# EAGLE design board2 (EAGLE 7.2.0)
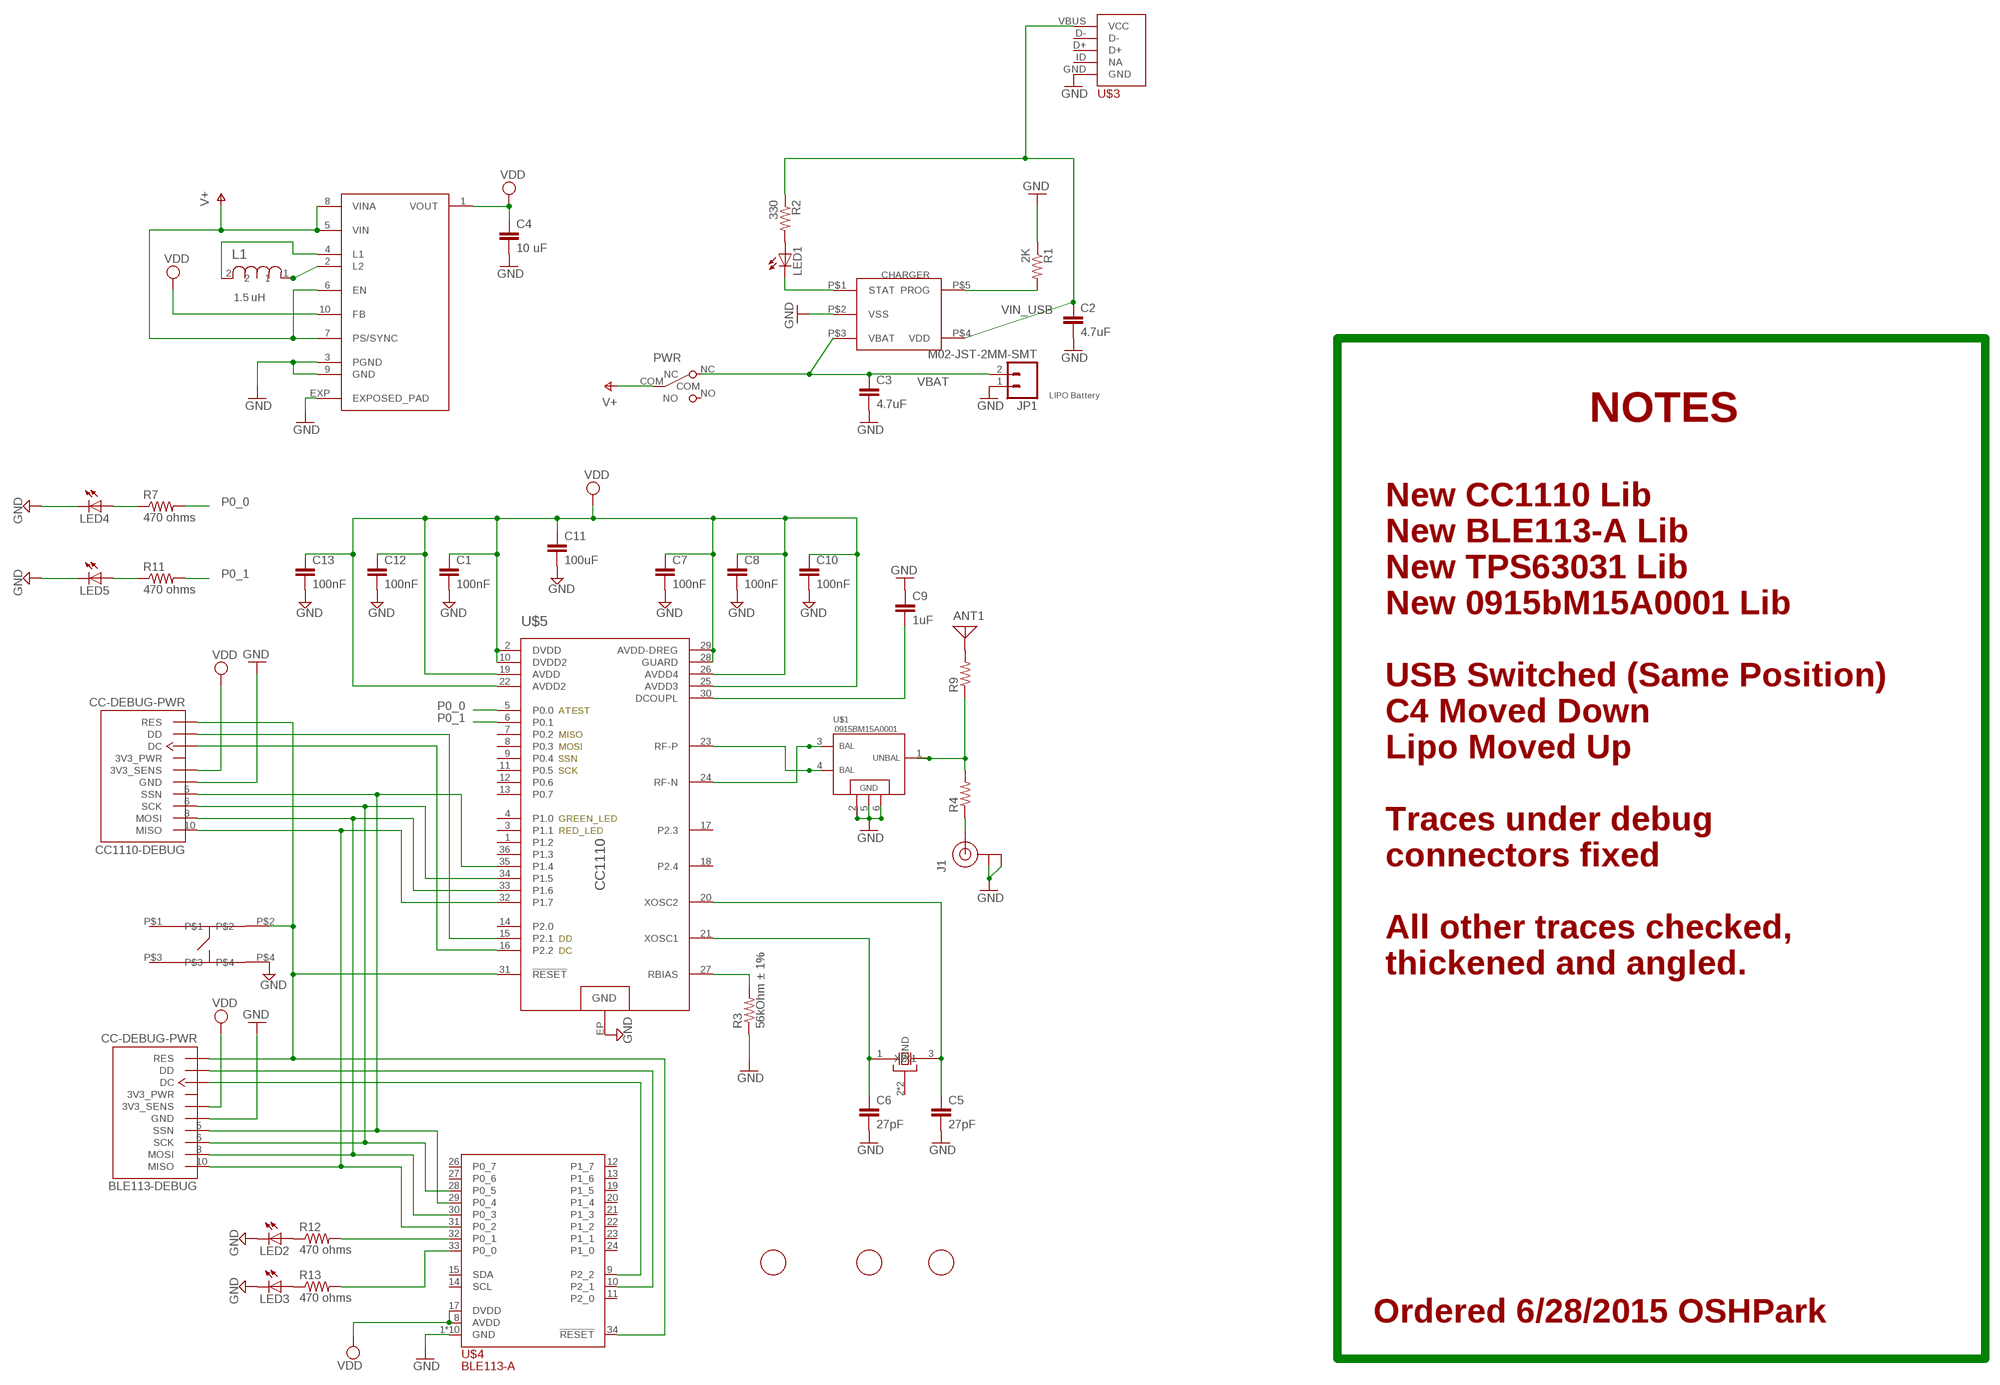
[diagram p0: schematic, sheet 1]

## Parts
ANT1  ANTENNA  [PAD-01]
BLE113-DEBUG  CC-DEBUG-PWR  [CC-P05]
C1  100nF  C-EUC0402  [C0402]
C2  4.7uF  C-EUC0402K  [C0402K]
C3  4.7uF  C-EUC0603K  [C0603K]
C4  10 uF  C-EUC0805K  [C0805K]
C5  27pF  C-EUC0402K  [C0402K]
C6  27pF  C-EUC0402K  [C0402K]
C7  100nF  C-EUC0402  [C0402]
C8  100nF  C-EUC0402  [C0402]
C9  1uF  C-EUC0402K  [C0402K]
C10  100nF  C-EUC0402  [C0402]
C11  100uF  C-EUC0402  [C0402]
C12  100nF  C-EUC0402  [C0402]
C13  100nF  C-EUC0402  [C0402]
CC1110-DEBUG  CC-DEBUG-PWR  [CC-P05]
CHARGER  MCP73831  [5PIN_SOT23]
FID1  FIDUCIAL  [FIDUCIAL_1MM]
FID2  FIDUCIAL  [FIDUCIAL_1MM]
FID3  FIDUCIAL  [FIDUCIAL_1MM]
J1  U.FL  [U.FL]
JP1  M02-JST-2MM-SMT  [JST-2-SMD]
L1  1.5 uH  PM0603-R12J-RC  [INDC1610X12N]
LED1  LEDSML0603  [SML0603]
LED2  LEDSML0603  [SML0603]
LED3  LEDSML0603  [SML0603]
LED4  LEDSML0603  [SML0603]
LED5  LEDSML0603  [SML0603]
PWR  SW_SLIDE  [SLIDE_SWITCH_SMD]
R1  2K  R-US_R0402  [R0402]
R2  330  R-US_R0402  [R0402]
R3  56kOhm ± 1%  R-US_R0402  [R0402]
R4  R-US_R0402  [R0402]
R7  470 ohms  R-US_R0402  [R0402]
R9  R-US_R0402  [R0402]
R11  470 ohms  R-US_R0402  [R0402]
R12  470 ohms  R-US_R0402  [R0402]
R13  470 ohms  R-US_R0402  [R0402]
U$1  0915BM15A0001_BANDPASS  [0915BM15A0001]
U$2  TACTILE_SWITCH  [PTS540]
U$3  USB_GENERICMINI_B  [USB_GENERIC]
U$4  BLE113-A  [BLE113-A]
U$5  CC1110  [QFN36]
U$6  TPS63031  [10SON]
X1  26MHz 10pF 10ppm -20C +70C  CTS_32X25_SMD  [CTS_32X25]

## Nets
DC: CC1110-DEBUG.3(DC) U$5.16(P2.2)
DC_BLE: BLE113-DEBUG.3(DC) U$4.9(P2_2)
DD: CC1110-DEBUG.4(DD) U$5.15(P2.1)
DD_BLE: BLE113-DEBUG.4(DD) U$4.10(P2_1)
GND: BLE113-DEBUG.1(GND) C1.2 C2.2 C3.2 C4.2 C5.2 C6.2 C7.2 C8.2 C9.1 C10.2 C11.2 C12.2 C13.2 CC1110-DEBUG.1(GND) CHARGER.P$2(VSS) J1.P$1(GND) J1.P$2(GND) JP1.1 LED2.C LED3.C LED4.C LED5.C R1.1 R3.1 U$1.2 U$1.5 U$1.6 U$2.P$4 U$3.GND U$4.1(GND) U$4.2(GND) U$4.3(GND) U$4.4(GND) U$4.5(GND) U$4.6(GND) U$4.7(GND) U$4.18(GND) U$4.25(GND) U$4.36(GND) U$5.EP(GND2) U$6.3(PGND) U$6.9(GND) U$6.EXP(EXPOSED_PAD)
MISO: BLE113-DEBUG.10(MISO) CC1110-DEBUG.10(MISO) U$4.31(P0_2) U$5.32(P1.7)
MOSI: BLE113-DEBUG.8(MOSI) CC1110-DEBUG.8(MOSI) U$4.30(P0_3) U$5.33(P1.6)
N$1: L1.1 U$6.2(L2)
N$2: CHARGER.P$1(STAT) LED1.C
N$3: CHARGER.P$5(PROG) R1.2
N$4: LED1.A R2.2
N$5: U$1.3 U$5.24(RF-N)
N$6: L1.2 U$6.4(L1)
N$7: U$1.4 U$5.23(RF-P)
N$9: J1.P$3(SIGNAL) R4.1
N$10: R4.2 R9.1 U$1.1
N$12: ANT1.1 R9.2
N$14: R3.2 U$5.27(RBIAS)
N$18: C9.2 U$5.30(DCOUPL)
N$20: C6.1 U$5.21(XOSC1) X1.1(X1)
N$21: C5.1 U$5.20(XOSC2) X1.3(X2)
N$24: LED4.A R7.1
N$25: LED5.A R11.1
N$29: LED2.A R12.1
N$30: LED3.A R13.1
N$31: R12.2 U$4.32(P0_1)
N$32: R13.2 U$4.33(P0_0)
P0_0: R7.2 U$5.5(P0.0)
P0_1: R11.2 U$5.6(P0.1)
RESET: BLE113-DEBUG.7(RES) CC1110-DEBUG.7(RES) U$2.P$2 U$4.34(!RESET!) U$5.31(!RESET)
SCK: BLE113-DEBUG.6(SCK) CC1110-DEBUG.6(SCK) U$4.28(P0_5) U$5.34(P1.5)
SSN: BLE113-DEBUG.5(SSN) CC1110-DEBUG.5(SSN) U$4.29(P0_4) U$5.35(P1.4)
V+: PWR.COM U$6.5(VIN) U$6.6(EN) U$6.7(PS/SYNC) U$6.8(VINA)
VBAT: C3.1 CHARGER.P$3(VBAT) JP1.2 PWR.NC
VDD: BLE113-DEBUG.2(3V3_SENS) C1.1 C4.1 C7.1 C8.1 C10.1 C11.1 C12.1 C13.1 CC1110-DEBUG.2(3V3_SENS) U$4.8(AVDD) U$4.17(DVDD) U$5.2(DVDD) U$5.10(DVDD2) U$5.19(AVDD) U$5.22(AVDD2) U$5.25(AVDD3) U$5.26(AVDD4) U$5.28(GUARD) U$5.29(AVDD-DREG) U$6.1(VOUT) U$6.10(FB)
VIN_USB: C2.1 CHARGER.P$4(VDD) R2.1 U$3.VBUS(VCC)
Unconnected: BLE113-DEBUG.9(3V3_PWR) CC1110-DEBUG.9(3V3_PWR) PWR.NO U$2.P$1 U$2.P$3 U$3.D+ U$3.D- U$3.ID(NA) U$4.11(P2_0) U$4.12(P1_7) U$4.13(P1_6) U$4.14(SCL) U$4.15(SDA) U$4.19(P1_5) U$4.20(P1_4) U$4.21(P1_3) U$4.22(P1_2) U$4.23(P1_1) U$4.24(P1_0) U$4.26(P0_7) U$4.27(P0_6) U$5.1(P1.2) U$5.3(P1.1) U$5.4(P1.0) U$5.7(P0.2) U$5.8(P0.3) U$5.9(P0.4) U$5.11(P0.5) U$5.12(P0.6) U$5.13(P0.7) U$5.14(P2.0) U$5.17(P2.3) U$5.18(P2.4) U$5.36(P1.3)

## Notes on the sheet
- LIPO Battery
- NOTES
- New CC1110 Lib
  New BLE113-A Lib
  New TPS63031 Lib
  New 0915bM15A0001 Lib
- USB Switched (Same Position)
  C4 Moved Down
  Lipo Moved Up
- Traces under debug 
  connectors fixed
- All other traces checked, 
  thickened and angled.
- Ordered 6/28/2015 OSHPark

## Power pins joined to a net without a drawn wire
GND: X1.2(GND) X1.4(GND)

## Library data of the parts
ANT1 = discrete:ANTENNA: Antenna
BLE113-DEBUG CC1110-DEBUG = parts:CC-DEBUG-PWR: CC debugger connection with various form factors. 2x5-pin 0.05" pitch header include Pin 9 (VDD) supply connection as separate pin. https://github.com/jrowberg/sf-oshw Last updated 2014-01-04 by Jeff Rowberg <jeff@rowberg.net>
C1-C13 = rcl:C-EU: CAPACITOR, European symbol
CHARGER = parts:MCP73831: Digikey No:- __MCP73831T-2ACI/OTCT-ND__
FID1-FID3 = adafruit:FIDUCIAL: For use by pick and place machines to calibrate the vision/machine, 1mm By microbuilder.eu
J1 = SparkFun-Connectors:U.FL: SMD antenna connector- WRL-09144; PROD_ID: CONN-09193
JP1 = SparkFun-Connectors:M02: Standard 2-pin 0.1" header. Use with - straight break away headers ( PRT-00116) - right angle break away headers (PRT-00553) - swiss pins (PRT-00743) - machine pins (PRT-00117) - female headers (PRT-00115) Molex polarized connector foot print use with: PRT-08233 with associated crimp pins and housings. 2.54_SCREWTERM for use with PRT-10571. 3.5mm Screw Terminal footprints for PRT-08084 5mm Screw Terminal footprints for use with PRT-08432; PROD_ID: CONN-08352
L1 = Bourns_By_element14_Batch_1:PM0603-R12J-RC: CHIP INDUCTOR, 120NH, 300MA, 5%, 1300MHZ; MPN: PM0603-R12J-RC; OC_FARNELL: -; OC_NEWARK: 86K1771; SUPPLIER: BOURNS; TOLERANCE: ±5 %; VALUE: 120 nH
LED1-LED5 = led:LED: LED OSRAM: - CHIPLED LG R971, LG N971, LY N971, LG Q971, LY Q971, LO R971, LY R971 LH N974, LH R974 LS Q976, LO Q976, LY Q976 LO Q996 - Hyper CHIPLED LW Q18S LB Q993, LB Q99A, LB R99A - SideLED LS A670, LO A670, LY A670, LG A670, LP A670 LB A673, LV A673, LT A673, LW A673 LH A674 LY A675 LS A676, LA A676, LO A676, LY A676, LW A676 LS A679, LY A679, LG A679 - Hyper Micro SIDELED® LS Y876, LA Y876, LO Y876, LY Y876 LT Y87S - SmartLED LW L88C, LW L88S LB L89C, LB L89S, LG L890 LS L89K, LO L89K, LY L89K LS L896, LA L896, LO L896, LY L896 - TOPLED LS T670, LO T670, LY T670, LG T670, LP T670 LSG T670, LSP T670, LSY T670, LOP T670, LYG T670 LG T671, LOG T671, LSG T671 LB T673, LV T673, LT T673, LW T673 LH T674 LS T676, LA T676, LO T676, LY T676, LB T676, LH T676, LSB T676, LW T676 LB T67C, LV T67C, LT T67C, LS T67K, LO T67K, LY T67K, LW E67C LS E67B, LA E67B, LO E67B, LY E67B, LB E67C, LV E67C, LT E67C LW T67C LS T679, LY T679, LG T679 LS T770, LO T770, LY T770, LG T770, LP T770 LB T773, LV T773, LT T773, LW T773 LH T774 LS E675, LA E675, LY E675, LS T675 LS T776, LA T776, LO T776, LY T776, LB T776 LHGB T686 LT T68C, LB T68C - Hyper Mini TOPLED® LB M676 - Mini TOPLED Santana® LG M470 LS M47K, LO M47K, LY M47K Source: http://www.osram.convergy.de LUXEON: - LUMILED® LXK2-PW12-R00, LXK2-PW12-S00, LXK2-PW14-U00, LXK2-PW14-V00 LXK2-PM12-R00, LXK2-PM12-S00, LXK2-PM14-U00 LXK2-PE12-Q00, LXK2-PE12-R00, LXK2-PE12-S00, LXK2-PE14-T00, LXK2-PE14-U00 LXK2-PB12-K00, LXK2-PB12-L00, LXK2-PB12-M00, LXK2-PB14-N00, LXK2-PB14-P00, LXK2-PB14-Q00 LXK2-PR12-L00, LXK2-PR12-M00, LXK2-PR14-Q00, LXK2-PR14-R00 LXK2-PD12-Q00, LXK2-PD12-R00, LXK2-PD12-S00 LXK2-PH12-R00, LXK2-PH12-S00 LXK2-PL12-P00, LXK2-PL12-Q00, LXK2-PL12-R00 Source: www.luxeon.com KINGBRIGHT: KA-3528ASYC Source: www.kingbright.com
PWR = parts:SW_SLIDE
R1-R4 R7 R9 R11-R13 = rcl:R-US_: RESISTOR, American symbol
U$1 = riley:0915BM15A0001_BANDPASS
U$2 = parts:TACTILE_SWITCH: Ultra Low Profile SMT Top Actuated PTS540 JM035 SMTR LFS Datasheet <http://www.mouser.com/ds/2/60/PTS540_9sept14-372441.pdf>
U$3 = AtomTech:USB_GENERIC
U$4 = riley:BLE113-A
U$5 = riley:CC1110
U$6 = riley:TPS63031
X1 = cts_crystal:CTS_32X25_SMD

## Board
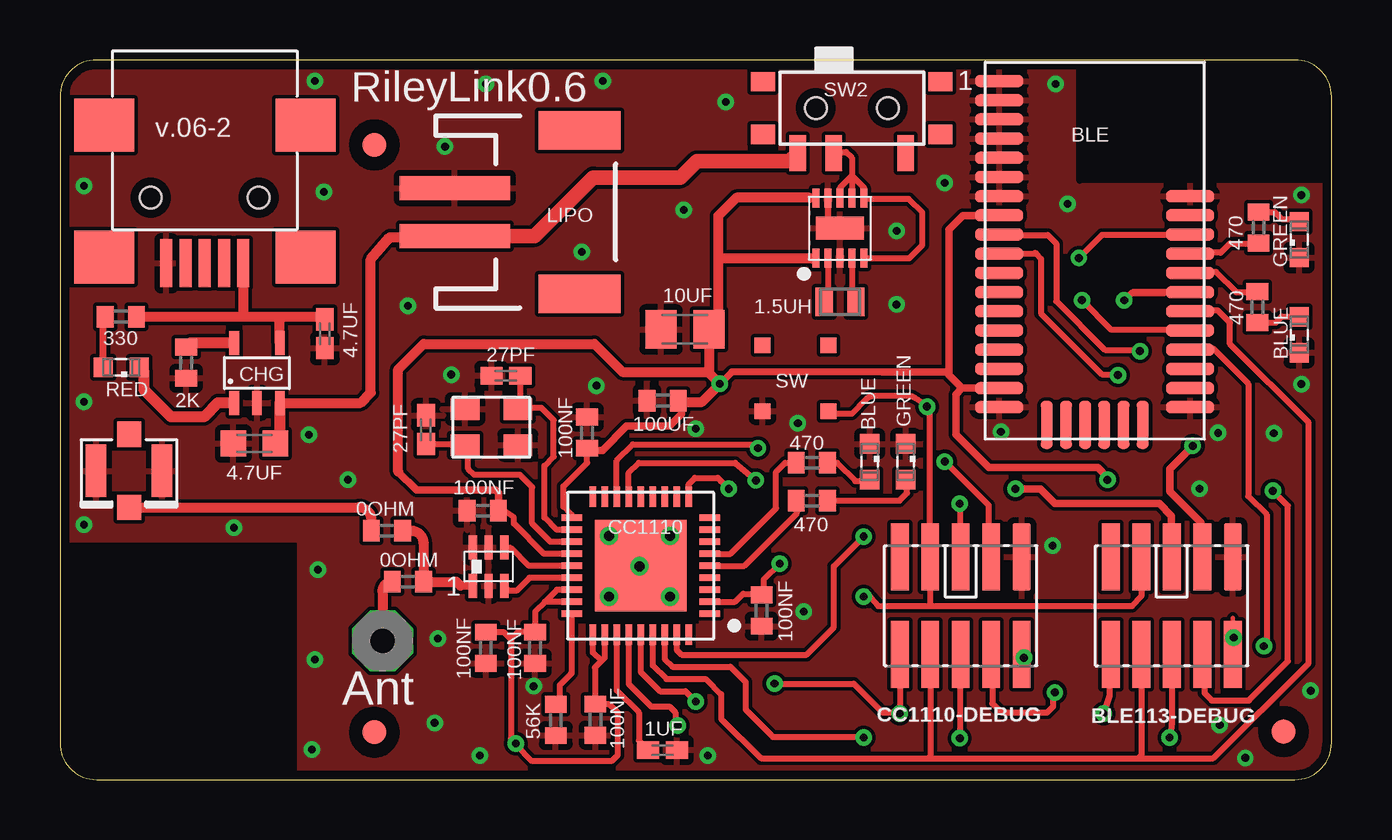
[diagram p1: board, top side]
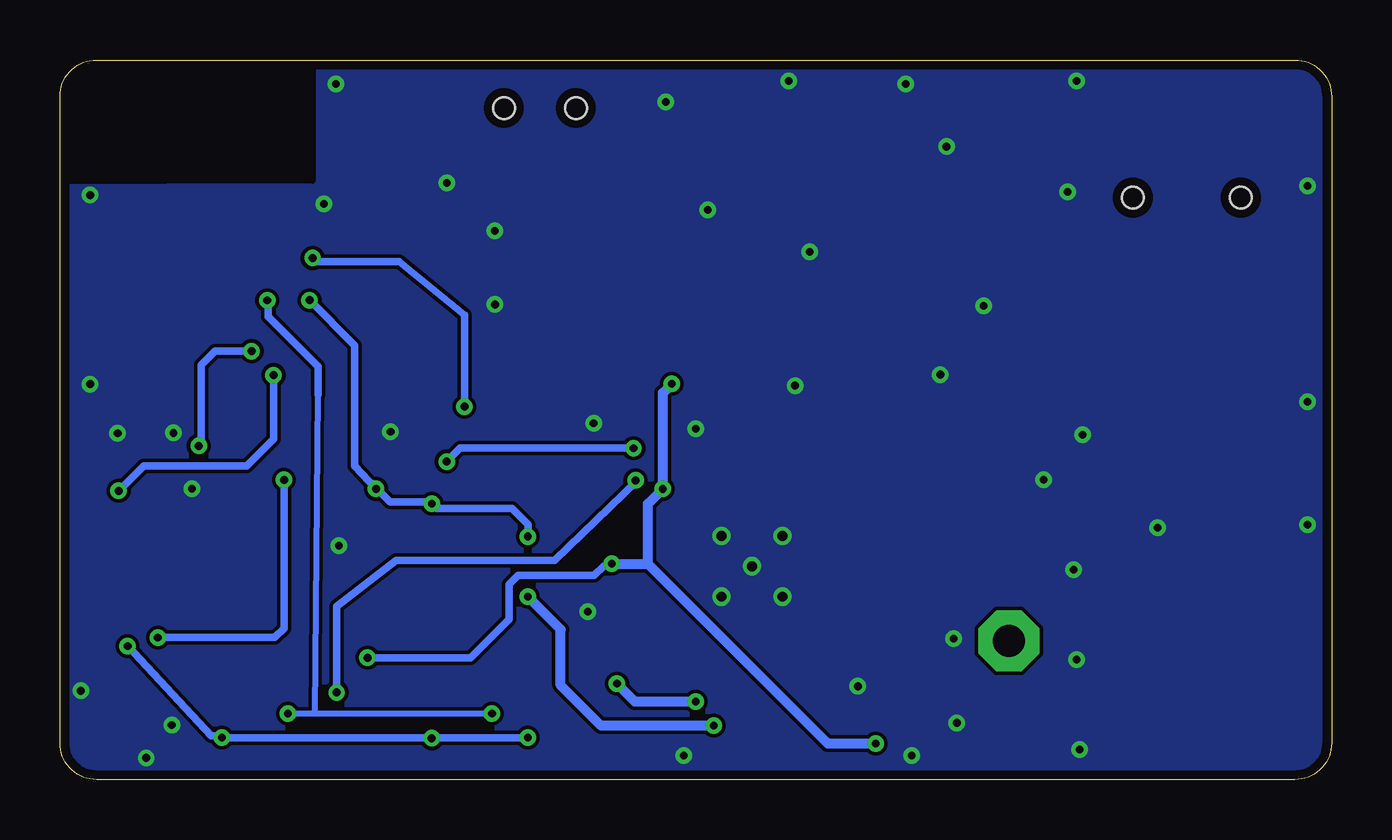
[diagram p2: board, bottom side, seen from below]

Size 53 x 30 mm. Coordinates in mm from the lower left corner, seen from the top.
Outline: 0,28.48 0,1.52 arc90 1.52,0 51.48,0 arc90 53,1.52 53,28.48 arc90 51.48,30 1.52,30 arc90 0,28.48
Copper layers (1*16): Top 0.0356mm / dielectric 1.5011mm / Bottom 0.0356mm
Design rules "oshpark *": minimum track width 6mil, minimum drill 13mil, track to track 6mil, track to pad 6mil, pad to pad 6mil, via to via 6mil, smd to smd 6mil, copper to edge 15mil, drill to drill 6mil, minimum pad ring 7mil, minimum via ring 7mil, stop-mask expansion 3mil, vias tented up to drill 21mil, thermal gap 10mil
tRestrict: area 42.5,25 to 54.6,30.5; area 21.8,6.5 to 26.6,11.4
bRestrict: area 42.5,24.9 to 54.7,30.4

### Footprints (pad centres in the part's own frame; a part is rotated, then mirrored left to right if it is on the bottom)
PAD-01 = drill 1.321 pad 2.54 octagon: 1 0,0
CC-P05 = smd 0.74 x 2.8: 1 -2.54,-2.03; 2 -2.54,2.03; 3 -1.27,-2.03; 4 -1.27,2.03; 5 0,-2.03; 6 0,2.03; 7 1.27,-2.03; 8 1.27,2.03; 9 2.54,-2.03; 10 2.54,2.03
C0402 = smd 0.7 x 0.9: 1 -0.65,0; 2 0.65,0
C0402K = smd 0.925 x 0.74: 1 -0.6,0; 2 0.6,0
C0603K = smd 1.05 x 1.08: 1 -0.875,0; 2 0.875,0
C0805K = smd 1.3 x 1.6: 1 -1,0; 2 1,0
5PIN_SOT23 = smd 0.4 x 1: P$1 0.4,-0.63; P$2 1.35,-0.63; P$3 2.3,-0.63; P$4 2.3,1.87; P$5 0.4,1.87
FIDUCIAL_1MM = smd 1 x 1: 1 0,0
U.FL = smd 2.2 x 0.85: P$1 0,1.375; P$2 0,-1.375 | smd 1.05 x 1: P$3 1.525,0; P$4 -1.525,0
JST-2-SMD = smd 1 x 4.6: 1 -1,-3.7; 2 1,-3.7 | smd 1.6 x 3.4: NC1 -3.4,1.5; NC2 3.4,1.5
INDC1610X12N = smd 0.711 x 1.194: 1 -0.66,0; 2 0.66,0
SML0603 = smd 0.8 x 0.8: A 0.75,0; C -0.75,0
SLIDE_SWITCH_SMD = smd 0.7 x 1.5: COM 0.75,1.875; NC 2.25,1.875; NO -2.25,1.875 | smd 1 x 0.8: P$1 -3.7,-1.1; P$2 -3.7,1.1; P$3 3.7,1.1; P$4 3.7,-1.1 | hole 0.9: -1.5,0; 1.5,0
R0402 = smd 0.7 x 0.9: 1 -0.65,0; 2 0.65,0
0915BM15A0001 = smd 0.35 x 1: 1 -0.64,-0.81; 2 0.01,-0.81; 3 0.66,-0.81; 4 0.66,0.79; 5 0.01,0.79; 6 -0.64,0.79
PTS540 = smd 0.65 x 0.65: P$1 -1.375,1.375; P$2 1.375,1.375; P$3 -1.375,-1.375; P$4 1.375,-1.375
USB_GENERIC = smd 0.5 x 2: D+ -0.04,4.71; D- -0.84,4.71; GND 1.56,4.71; ID 0.76,4.71; VBUS -1.64,4.71 | smd 2.5 x 2.2: GND@1 4.16,-1.04; GND@2 -4.24,-1.04; GND@3 -4.24,4.46; GND@4 4.16,4.46 | hole 0.9: -2.28,1.98; 2.22,1.98
BLE113-A = smd 2 x 0.5: 1 -3.975,7.075; 2 -3.975,6.275; 3 -3.975,5.475; 4 -3.975,4.675; 5 -3.975,3.875; 6 -3.975,3.075; 7 -3.975,2.275; 8 -3.975,1.475; 9 -3.975,0.675; 10 -3.975,-0.125; 11 -3.975,-0.925; 12 -3.975,-1.725; 13 -3.975,-2.525; 14 -3.975,-3.325; 15 -3.975,-4.125; 16 -3.975,-4.925; 17 -3.975,-5.725; 18 -3.975,-6.525; 25 3.975,-6.525; 26 3.975,-5.725; 27 3.975,-4.925; 28 3.975,-4.125; 29 3.975,-3.325; 30 3.975,-2.525; 31 3.975,-1.725; 32 3.975,-0.925; 33 3.975,-0.125; 34 3.975,0.675; 35 3.975,1.475; 36 3.975,2.275 | smd 0.5 x 2: 19 -2,-7.265; 20 -1.2,-7.265; 21 -0.4,-7.265; 22 0.4,-7.265; 23 1.2,-7.265; 24 2,-7.265
QFN36 = smd 0.28 x 0.85: 1 -2,-2.875; 2 -1.5,-2.875; 3 -1,-2.875; 4 -0.5,-2.875; 5 0,-2.875; 6 0.5,-2.875; 7 1,-2.875; 8 1.5,-2.875; 9 2,-2.875; 19 2,2.875; 20 1.5,2.875; 21 1,2.875; 22 0.5,2.875; 23 0,2.875; 24 -0.5,2.875; 25 -1,2.875; 26 -1.5,2.875; 27 -2,2.875 | smd 0.85 x 0.28: 10 2.875,-2; 11 2.875,-1.5; 12 2.875,-1; 13 2.875,-0.5; 14 2.875,0; 15 2.875,0.5; 16 2.875,1; 17 2.875,1.5; 18 2.875,2; 28 -2.875,2; 29 -2.875,1.5; 30 -2.875,1; 31 -2.875,0.5; 32 -2.875,0; 33 -2.875,-0.5; 34 -2.875,-1; 35 -2.875,-1.5; 36 -2.875,-2 | smd 3.8 x 3.8: EP 0,0
10SON = smd 0.28 x 0.8: 1 -1,-1.25; 2 -0.5,-1.25; 3 0,-1.25; 4 0.5,-1.25; 5 1,-1.25; 6 1,1.25; 7 0.5,1.25; 8 0,1.25; 9 -0.5,1.25; 10 -1,1.25 | smd 2 x 0.95: EXP 0,0
CTS_32X25 = smd 1.2 x 0.9: 1 -1.1,-0.7; 2 1.1,-0.7; 3 1.1,0.8; 4 -1.1,0.8

### Placement (x,y rotation side)
ANT1  13.45,5.78 0 top
BLE113-DEBUG  46.34,7.25 180 top
C1  29.24,7.04 270 top
C2  11.04,18.59 270 top
C3  8.1,14.01 180 top
C4  26.05,18.77 180 top
C5  18.59,16.84 180 top
C6  15.26,14.59 90 top
C7  22.32,2.5 270 top
C8  17.75,5.5 270 top
C9  25.11,1.23 180 top
C10  19.8,5.5 270 top
C11  25.12,15.8 180 top
C12  21.97,14.46 90 top
C13  17.62,11.21 180 top
CC1110-DEBUG  37.55,7.25 180 top
CHARGER  6.86,16.33 0 top
FID1  13.1,1.97 0 top
FID2  13.1,26.46 0 top
FID3  51,2 0 top
J1  2.88,12.88 270 top
JP1  20.16,23.66 270 top
L1  32.52,19.92 0 top
LED1  2.55,17.19 180 top
LED2  51.65,18.54 90 top
LED3  51.65,22.51 90 top
LED4  35.25,13.25 270 top
LED5  33.75,13.25 270 top
PWR  33,28 180 top
R1  5.26,17.38 90 top
R2  2.54,19.3 180 top
R3  20.66,2.48 90 top
R4  13.62,10.38 0 top
R7  31.34,11.63 180 top
R9  14.5,8.25 180 top
R11  31.34,13.21 180 top
R12  49.91,19.7 90 top
R13  49.96,23.01 270 top
U$1  17.86,8.89 0 top
U$2  30.66,16.73 270 top
U$3  5.99,26.24 180 top
U$4  43.13,22.05 0 top
U$5  24.21,8.92 90 top
U$6  32.51,22.99 0 top
X1  17.98,14.64 0 top

### Tracks (layer width: path | path; a pad name or v marks a point on that pad's centre or on a via)
DC  (via drill 0.33)
  Top 0.152: 38.71,9.3 CC1110-DEBUG.3
  Top 0.24: v36.88,13.26 38.71,11.43 38.71,9.3
  Top 0.254: v29.09,13.81 28.94,13.97 23.88,13.97 23.21,13.3 U$5.16
  Bottom 0.305: v29.09,13.81 36.33,13.81 v36.88,13.26
DC_BLE  (via drill 0.33)
  Top 0.152: 40.08,22.71 39.47,22.71 | 47.55,9.3 BLE113-DEBUG.3
  Top 0.24: 47.55,9.3 47.55,9.45
  Top 0.254: 40.08,22.71 41.17,22.71 41.53,22.35 41.53,19.94 43.56,17.91 44.8,17.91 v45.01,17.86
  Top 0.305: 47.55,9.45 47.55,10.72 46.25,12.01 46.25,12.95 v47.22,13.91
  Top 0.406: 39.47,22.71 39.17,22.71 U$4.9
  Bottom 0.305: v45.01,17.86 46.53,17.86 47.12,17.27 47.12,14.01 v47.22,13.91
DD  (via drill 0.33)
  Top 0.152: 38.86,4.27 38.86,5.18 CC1110-DEBUG.4
  Top 0.254: v29.01,12.47 28.14,13.21 24.13,13.21 23.71,12.78 U$5.15 | 38.86,4.27 38.86,3.17 39.24,2.79 41.15,2.79 41.4,3.05 41.4,3.56 v41.47,3.63
  Bottom 0.305: v29.01,12.47 28.93,12.47 32.38,9.14 38.99,9.14 41.48,7.21 41.48,4.18 v41.47,3.63
DD_BLE  (via drill 0.33)
  Top 0.152: 47.7,4.27 47.7,5.18 BLE113-DEBUG.4
  Top 0.254: 47.7,4.27 47.7,3.61 48.01,3.3 49.55,3.3 51.18,4.93 51.18,11.41 v50.55,12.04 | 40.65,21.96 40.69,21.92 | v44.1,16.86 44.07,16.89 43.43,16.89 40.89,19.43 40.89,21.72 40.69,21.92 | U$4.10 40.69,21.92
  Bottom 0.305: v44.1,16.86 44.1,14.2 45.21,13.08 49.51,13.08 v50.55,12.04
GND  (via drill 0.33, 0.33 pad 0.41, 0.41)
  Top 0.254: U$6.9 32.01,23.49
  Top 0.26: C10.2 20,5
  other vias: 10.75,8.75 11,24.5 26,23.75 27.75,28.25 34.88,22.88 51.75,24.37 21.75,22 51.75,16.48 52.13,3.7 49.41,0.9 41.38,9.75 16.3,16.88 10.38,14.38 14.5,19.75 10.62,5 15.75,5.88 17.5,1 12,12.5 41.5,29 16.04,26.39 42,24 31,7 19.75,3.89 27,1 47.5,12.12 39.23,14.5 34.87,19.81 1,10.62 7.25,10.5 1,15.75 1,24.75 36.88,24.88 22.62,29.12 17.75,29 10.62,29.12 10.5,1.25 15.62,2.36 22.36,16.42 26.5,14.62 30.75,14.86 22.89,10.16 25.43,10.16 25.43,7.62 22.89,7.62 24.16,8.89 48.27,14.45 48.34,2.27 50.6,14.44
  pour Bottom: 0,30 53,30 53,0 0,0
  pour Top: 10,0 10,10 0,10 0,30 53,30 53,0
MISO  (via drill 0.33)
  Top 0.152: 46.02,20.27 46.79,20.27
  Top 0.24: v43.5,2.75 43.75,3.5 43.75,5.17 BLE113-DEBUG.10
  Top 0.254: v26.5,3.25 26.07,3.68 25.02,3.68 24.21,4.5 U$5.32 | v29.79,4 33.08,4 34.29,2.79 35.21,2.79 v35,2.75 35.01,3 CC1110-DEBUG.10 | 46.02,20.27 44.65,20.27 v44.36,19.98 44.7,20.32 U$4.31
  Bottom 0.152: 42.37,2.74 42.37,2.75
  Bottom 0.24: v35,2.75 42.37,2.75 | 42.37,2.75 v43.5,2.75 | 42.37,2.75 42.24,16.05
  Bottom 0.305: 42.24,16.05 42.24,17.22 44.32,19.3 44.32,19.94 v44.36,19.98
  Bottom 0.406: v26.5,3.25 29.04,3.25 v29.79,4
MOSI
  Top 0.254: 36.2,0.89 29.21,0.89 27.56,2.54 27.56,3.56 26.92,4.19 25.27,4.19 24.71,4.76 U$5.33 | 36.2,0.89 44.96,0.89 | 47.07,19.56 48.26,19.56 48.77,19.05 48.77,18.16 52.05,14.88 52.05,4.85 48.08,0.89 44.96,0.89 | BLE113-DEBUG.8 45.07,1 44.96,0.89 | CC1110-DEBUG.8 36.27,0.97 36.2,0.89 | 46.85,19.56 47.07,19.56 | 47.07,19.56 U$4.30
N$1
  Top 0.254: U$6.2 32.01,20.08 L1.1
  Top 0.305: 31.99,20.06 L1.1
N$2
  Top 0.45: CHARGER.P$1 6.58,15.7 6,15.12 4.62,15.12 3.5,16.25 3.5,16.99 LED1.C
N$3
  Top 0.45: CHARGER.P$5 5.43,18.2 R1.2
N$4
  Top 0.3: LED1.A 1.8,19.21 R2.2
N$5
  Top 0.254: U$5.24 19.57,8.41 19.02,7.87 18.72,7.87 U$1.3
N$6
  Top 0.24: 33.01,21.99 33,22
  Top 0.254: L1.2 33.01,20.08 U$6.4 33.01,21.99
  Top 0.305: 33,20.09 L1.2
N$7
  Top 0.254: 18.62,9.65 18.8,9.65 19.53,8.91 U$5.23
  Top 0.305: 18.62,9.65 18.54,9.65 U$1.4
N$9
  Top 0.406: J1.P$3 12.47,11.35 arc-90 12.97,10.84 R4.1
N$10
  Top 0.305: 16.69,8.08 U$1.1
  Top 0.406: R4.2 14.64,10.38 arc-90 15.15,9.87 R9.1 16.52,8.25 16.69,8.08
N$12
  Top 0.406: R9.2 arc90 13.45,7.84 ANT1.1
N$14
  Top 0.254: R3.2 20.83,3.04 20.83,3.94 21.23,4.34 21.31,4.42 21.33,4.44 U$5.27
N$18
  Top 0.254: C9.2 24.13,1.61 24.13,2.79 23.21,3.72 U$5.30
N$20
  Top 0.24: C6.1 16.84,13.98 X1.1
  Top 0.254: X1.1 17.02,13.81 17.02,12.95 17.27,12.7 19.18,12.7 19.68,12.19 19.68,10.67 20.44,9.91 U$5.21
N$21
  Top 0.24: 19.38,15.62 19,15.62 19.08,15.54 19.18,15.54 | C5.1 19.18,15.54 | 19.18,15.54 X1.3
  Top 0.254: X1.3 19.13,15.49 20.07,15.49 20.57,14.99 20.57,13.46 20.19,13.08 20.19,10.92 20.7,10.41 U$5.20
N$24
  Top 0.254: R7.1 35,11.63 35.31,11.94 35.31,12.44 LED4.A
N$25
  Top 0.254: R11.1 32.39,13.21 33.15,12.45 33.7,12.45 LED5.A
N$29
  Top 0.254: R12.1 50.67,19.05 50.93,19.3 51.64,19.3 LED2.A
N$30
  Top 0.254: R13.1 50.63,23.66 50.93,23.37 51.54,23.37 LED3.A
N$31
  Top 0.254: R12.2 49.63,20.32 49.02,20.32 48.18,21.16 47.15,21.16 U$4.32
N$32
  Top 0.254: R13.2 49.7,22.35 48.77,22.35 48.38,21.96 47.15,21.96 U$4.33
P0_0
  Top 0.254: 30.73,11.18 30.73,11.59 R7.2 30.71,11.61 30.71,11.1 28.52,8.91 U$5.5
P0_1
  Top 0.254: R11.2 30.23,13.21 29.84,12.83 29.84,11.3 27.96,9.41 U$5.6
RESET  (via drill 0.33)
  Top 0.152: 36.27,15.54 36.25,15.5
  Top 0.24: CC1110-DEBUG.7 36.25,8.64 36.25,15.5 35.63,15.91 arc34 35.35,16 33.96,16 arc45 33.6,15.85 33,15.25 32.14,15.25 U$2.P$2 | 36.27,15.54 v36.14,15.54
  Top 0.254: v25.75,2.25 25.65,2.35 25.65,2.79 25.4,3.05 24.64,3.05 23.71,3.98 U$5.31 | v42.47,21.74 43.43,22.71 47.09,22.71 U$4.34 | v33.5,7.62 33.78,7.62 34.11,7.24 36.27,7.24 | 36.27,7.24 44.68,7.24 45.09,7.67 45.09,9.27 BLE113-DEBUG.7 | 36.25,8.64 36.25,7.31 36.27,7.24
  Bottom 0.305: v36.14,15.54 36.14,19.36 38.86,21.59 42.32,21.59 v42.47,21.74
  Bottom 0.406: v25.75,2.25 30.44,2.25 32.13,3.94 32.13,6.26 v33.5,7.62
SCK  (via drill 0.33)
  Top 0.24: 37.5,4.42 CC1110-DEBUG.6 | BLE113-DEBUG.6 46.34,2.34 v46.25,1.75
  Top 0.254: v33.5,1.75 33.47,1.78 29.72,1.78 28.57,2.92 28.57,4.06 27.94,4.7 25.53,4.7 25.21,5.02 U$5.34 | 37.5,4.42 v37.5,1.72 | v50.18,5.56 50.29,5.42 50.29,11.05 49.53,11.81 49.53,16.51 48.08,17.96 47.15,17.96 U$4.28
  Bottom 0.152: 46.33,1.83 v46.25,1.75
  Bottom 0.24: 37.47,1.75 v37.5,1.72
  Bottom 0.305: v33.5,1.75 37.47,1.75 | 37.47,1.75 v37.5,1.72 | 37.47,1.75 v46.25,1.75 | 46.33,1.83 46.7,1.83 v50.18,5.56
SSN  (via drill 0.33)
  Top 0.152: 46.33,10.67 46.33,9.3 BLE113-DEBUG.5
  Top 0.24: v37.5,11.5 37.5,8.57 CC1110-DEBUG.5
  Top 0.254: v33.5,10.13 32.26,8.89 32.26,6.35 31.11,5.21 25.91,5.21 25.71,5.41 U$5.35 | v42.6,19.98 43.83,18.75 47.08,18.75 U$4.29
  Top 0.305: 46.33,10.67 46.33,11 45.82,11.51 41.48,11.51 40.87,12.12 v39.83,12.12 v39.82,12.12
  Bottom 0.152: 37.64,11.58 v37.5,11.5
  Bottom 0.305: v33.5,10.13 33.5,10.64 34.16,11.3 37.3,11.3 v37.5,11.5 | 37.64,11.58 39.24,11.58 39.99,12.34 v39.82,12.12 40.72,13.06 40.72,18.1 v42.6,19.98
V+
  Top 0.254: 33.01,25.17 33.01,25.92 32.77,26.16 32.29,26.16 | 33.01,25.17 U$6.7 | U$6.5 35.4,21.74 35.94,22.28 35.94,23.65 35.38,24.21 33.54,24.21 U$6.6 33.51,24.67 33.01,25.17 | U$6.8 32.51,24.68 33.01,25.17
  Top 0.406: 32.29,26.16 PWR.COM
VBAT
  Top 0.406: CHARGER.P$3 12.53,15.7 12.95,16.13 12.95,21.69 13.74,22.61 16.33,22.61 JP1.2
  Top 0.45: CHARGER.P$3 9.16,14.19 C3.1
  Top 0.61: JP1.2 19.79,22.66 22.23,25.09 25.86,25.09 26.54,25.78 30.41,25.78 PWR.NC
VDD  (via drill 0.33)
  Top 0.152: 40.23,5.33 CC1110-DEBUG.2 40.08,5.33 | 48.77,5.33 BLE113-DEBUG.2 | C11.1 25.76,15.85 25.76,15.75
  Top 0.178: 22.73,3.17 C7.1 | BLE113-DEBUG.2 48.9,5.24 48.9,6.73
  Top 0.24: 25.76,15.75 25.75,15.75 | 21.88,13.71 C12.1
  Top 0.254: 27.55,12.45 v27.88,12.12 27.42,12.57 26.47,12.57 26.21,12.31 U$5.10 | 21.84,13.68 C12.1 21.97,13.21 20.99,12.22 20.99,11.38 21.33,11.04 U$5.19 | C8.1 18.49,6.15 18.8,5.84 | 18.8,5.84 18.8,1.7 v19,1.5 19,1.45 19.68,0.76 22.99,0.76 23.24,1.02 23.24,2.79 22.89,3.15 C7.1 | C10.1 19.1,6.15 18.8,5.84 | 18.29,11.3 18.21,11.23 18.03,11.23 C13.1 18.05,11.18 18.54,11.18 18.92,10.92 18.92,10.67 20.18,9.41 U$5.22 | 22.21,3.13 C7.1 | 29.19,7.75 29.34,7.75 29.34,8.34 v30,9 | 31.24,24.26 31.28,24.22 31.3,24.24 U$6.10 | U$5.26 20.22,7.42 | 20.22,7.42 19.81,7.01 19.81,6.16 | U$5.25 20.72,7.92 20.22,7.42 | U$5.2 28.14,7.42 28.47,7.75 29.19,7.75 | 29.19,7.75 C1.1 | U$5.29 22.71,5.08 22.57,4.94 | 22.57,4.94 22.3,4.67 22.3,3.17 C7.1 | U$5.28 22.21,5.3 22.57,4.94 | U$6.1 31.48,21.74 31.43,21.78
  Top 0.3: v27.5,16.5 28,17 34.29,17 | 25.76,15.75 25.76,15.74 25.88,15.62
  Top 0.305: 21.88,13.71 22.61,13.71 23.62,14.73 25.4,14.73 25.91,15.24 25.91,15.66 C11.1 | 31.43,21.78 31.37,21.72 | 18.29,11.3 18.29,11.94 18.16,12.06 14.86,12.06 14.1,12.83 | 19.81,6.16 C10.1 | U$4.17 37.6,16.32 | 37.6,16.32 37.06,16.87 37.06,17.07 | 37.06,17.07 37.06,22.94 37.64,23.52 U$4.8 | 34.29,17 36.99,17 37.06,17.07 | 48.77,5.33 48.77,5.77 v48.92,5.92 | 37.6,16.32 37.34,16.06 37.34,14.38 38.71,13.01 43.26,13.01 43.66,12.6 v43.66,12.5 | 40.23,5.33 40.23,5.13 v40.18,5.08
  Top 0.406: 27.55,16.46 27.55,16.64 27.5,16.58 v27.5,16.5 | 31.24,24.26 28.19,24.26 27.43,23.5 27.43,21.59 | 31.37,21.72 27.56,21.72 27.43,21.59 | 14.1,12.83 14.1,17.09 15.16,18.16 22.28,18.16 23.44,16.99 27.01,16.99 | 25.76,15.75 26.75,15.75 v27.5,16.5 | 27.01,16.99 v27.5,16.5 | 27.01,16.99 27.05,17.03 C4.1 27.43,19.28 27.43,21.59 | 39.11,23.56 U$4.8
  Bottom 0.152: 30.02,8.99 v30,9
  Bottom 0.254: 30.33,8.91 30.07,8.99 v30.01,8.99 v30,9
  Bottom 0.305: 30.33,8.91 30.73,8.51 33.91,8.51 34.29,8.13 34.29,6.68 35.89,5.08 v40.18,5.08 | v48.92,5.92 44.04,5.92 43.66,6.3 v43.66,12.5
  Bottom 0.406: 28.5,9 28.5,11.49 v27.88,12.12 27.88,16.12 v27.5,16.5 | v19,1.5 21,1.5 28.5,9 | v30,9 28.5,9
VIN_USB
  Top 0.406: R2.1 7.62,19.3 | 7.62,19.3 9.3,19.3 | 9.3,19.3 10.93,19.3 C2.1 | CHARGER.P$4 9.16,19.16 9.3,19.3 | U$3.VBUS 7.63,19.31 7.62,19.3

### Text on the board
tPlace: SW2 | 1 | v.06-2 | BLE | LIPO | 470 | GREEN | 10UF | 1.5UH | 470 | 330 | 4.7UF | 27PF | BLUE | CHG | SW | RED | 2K | 100NF | 100UF | BLUE | GREEN | 27PF | 470 | 4.7UF | 0OHM | 100NF | CC1110 | 470 | 0OHM | 1 | 100NF | 100NF | 100NF | 56K | 1UF | 100NF
tNames: RileyLink0.6 | Ant